# EAGLE design brmecg (EAGLE 6.1)
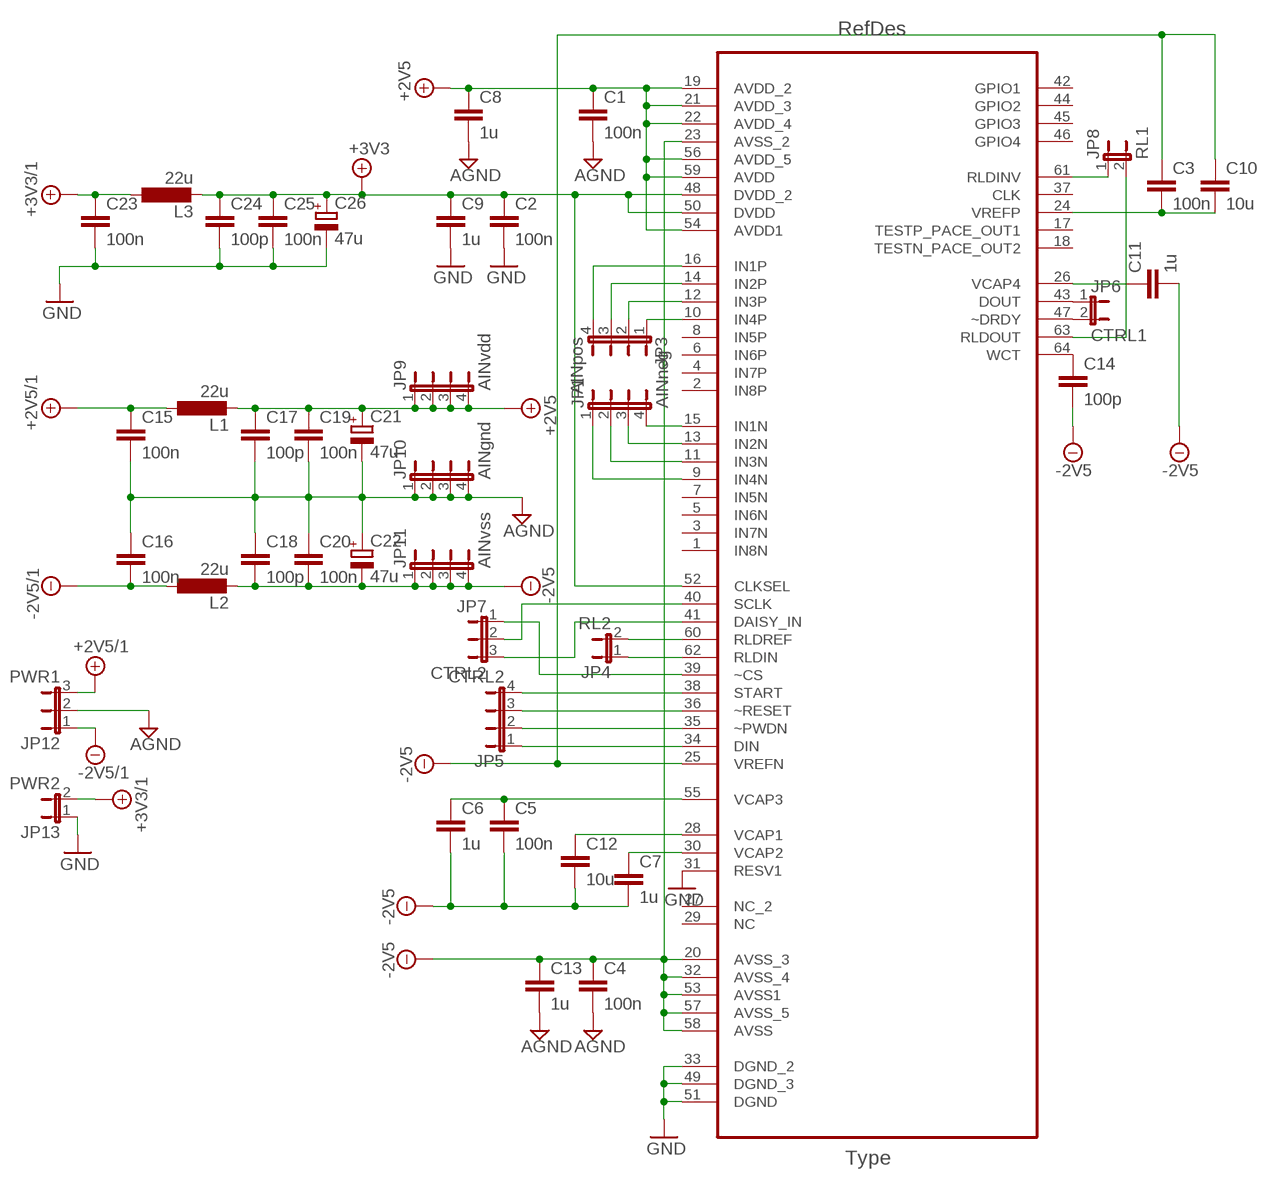
[diagram p0: schematic, sheet 1]

## Parts
C1  100n  C-EUC0603K  [C0603K]
C2  100n  C-EUC0603K  [C0603K]
C3  100n  C-EUC0603K  [C0603K]
C4  100n  C-EUC0603K  [C0603K]
C5  100n  C-EUC0603K  [C0603K]
C6  1u  C-EUC0805K  [C0805K]
C7  1u  C-EUC0805K  [C0805K]
C8  1u  C-EUC0805K  [C0805K]
C9  1u  C-EUC0805K  [C0805K]
C10  10u  C-EUC0805K  [C0805K]
C11  1u  C-EUC0805K  [C0805K]
C12  10u  C-EUC0805K  [C0805K]
C13  1u  C-EUC0805K  [C0805K]
C14  100p  C-EUC0603K  [C0603K]
C15  100n  C-EUC0603K  [C0603K]
C16  100n  C-EUC0603K  [C0603K]
C17  100p  C-EUC0603K  [C0603K]
C18  100p  C-EUC0603K  [C0603K]
C19  100n  C-EUC0603K  [C0603K]
C20  100n  C-EUC0603K  [C0603K]
C21  47u  CPOL-EUSMCC  [SMC_C]
C22  47u  CPOL-EUSMCC  [SMC_C]
C23  100n  C-EUC0603K  [C0603K]
C24  100p  C-EUC0603K  [C0603K]
C25  100n  C-EUC0603K  [C0603K]
C26  47u  CPOL-EUSMCC  [SMC_C]
JP1  AINneg  JP4E  [JP4]
JP3  AINpos  JP4E  [JP4]
JP4  RL2  JP1E  [JP1]
JP5  CTRL2  JP4E  [JP4]
JP6  CTRL1  JP1E  [JP1]
JP7  CTRL2  JP2E  [JP2]
JP8  RL1  JP1E  [JP1]
JP9  AINvdd  JP4E  [JP4]
JP10  AINgnd  JP4E  [JP4]
JP11  AINvss  JP4E  [JP4]
JP12  PWR1  JP2E  [JP2]
JP13  PWR2  JP1E  [JP1]
L1  22u  L-EUL1812  [L1812]
L2  22u  L-EUL1812  [L1812]
L3  22u  L-EUL1812  [L1812]
U1  ADS1194CPAG  [QFP50P1200X1200X120-64N]

## Nets
+2V5: C1.1 C8.1 C17.1 C19.1 C21.+ JP9.1 JP9.2 JP9.3 JP9.4 L1.2 U1.19(AVDD_2) U1.21(AVDD_3) U1.22(AVDD_4) U1.54(AVDD1) U1.56(AVDD_5) U1.59(AVDD)
+2V5/1: C15.1 JP12.3 L1.1
+3V3: C2.1 C9.1 C24.1 C25.1 C26.+ L3.2 U1.48(DVDD_2) U1.50(DVDD) U1.52(CLKSEL)
+3V3/1: C23.1 JP13.2 L3.1
-2V5: C3.1 C4.1 C5.2 C6.2 C7.2 C10.1 C11.2 C12.2 C13.1 C14.2 C18.2 C20.2 C22.- JP11.1 JP11.2 JP11.3 JP11.4 L2.2 U1.20(AVSS_3) U1.23(AVSS_2) U1.25(VREFN) U1.32(AVSS_4) U1.53(AVSS1) U1.57(AVSS_5) U1.58(AVSS)
-2V5/1: C16.2 JP12.1 L2.1
AGND: C1.2 C4.2 C8.2 C13.2 C15.2 C16.1 C17.2 C18.1 C19.2 C20.1 C21.- C22.+ JP10.1 JP10.2 JP10.3 JP10.4 JP12.2
DAISY_IN: JP7.3 U1.41(DAISY_IN)
DIN: JP5.1 U1.34(DIN)
DOUT: JP6.1 U1.43(DOUT)
GND: C2.2 C9.2 C23.2 C24.2 C25.2 C26.- JP13.1 U1.31(RESV1) U1.33(DGND_2) U1.49(DGND_3) U1.51(DGND)
N$1: C3.2 C10.2 U1.24(VREFP)
N$2: C5.1 C6.1 U1.55(VCAP3)
N$3: C7.1 U1.30(VCAP2)
N$4: C12.1 U1.28(VCAP1)
N$5: C11.1 U1.26(VCAP4)
N$6: JP1.4 U1.15(IN1N)
N$7: C14.1 U1.64(WCT)
N$8: JP1.3 U1.13(IN2N)
N$9: JP1.2 U1.11(IN3N)
N$10: JP1.1 U1.9(IN4N)
N$11: JP3.1 U1.10(IN4P)
N$12: JP3.4 U1.16(IN1P)
N$13: JP3.3 U1.14(IN2P)
N$14: JP3.2 U1.12(IN3P)
N$15: JP4.1 U1.62(RLDIN)
N$16: JP4.2 U1.60(RLDREF)
N$17: JP8.1 U1.61(RLDINV)
N$24: JP8.2 U1.63(RLDOUT)
SCLK: JP7.2 U1.40(SCLK)
START: JP5.4 U1.38(START)
~CS: JP7.1 U1.39(~CS)
~DRDY: JP6.2 U1.47(~DRDY)
~PWDN: JP5.2 U1.35(~PWDN)
~RESET: JP5.3 U1.36(~RESET)
Unconnected: U1.1(IN8N) U1.2(IN8P) U1.3(IN7N) U1.4(IN7P) U1.5(IN6N) U1.6(IN6P) U1.7(IN5N) U1.8(IN5P) U1.17(TESTP_PACE_OUT1) U1.18(TESTN_PACE_OUT2) U1.27(NC_2) U1.29(NC) U1.37(CLK) U1.42(GPIO1) U1.44(GPIO2) U1.45(GPIO3) U1.46(GPIO4)

## Library data of the parts
C1-C20 C23-C25 = rcl:C-EU: CAPACITOR, European symbol
C21 C22 C26 = rcl:CPOL-EU: POLARIZED CAPACITOR, European symbol
JP1 JP3 JP5 JP9-JP11 = jumper:JP4E: JUMPER
JP4 JP6 JP8 JP13 = jumper:JP1E: JUMPER
JP7 JP12 = jumper:JP2E: JUMPER
L1-L3 = rcl:L-EU: INDUCTOR, European symbol
U1 = adc-ti:ADS1194CPAG: Analog Front-End for Biopotential Measurements; DESCRIPTION: Analog Front-End for Biopotential Measurements; MPN: ADS1194CPAG; OC_FARNELL: 1855110; OC_NEWARK: 13T1868; PACKAGE: TQFP-64; SUPPLIER: Texas Instruments

## Board
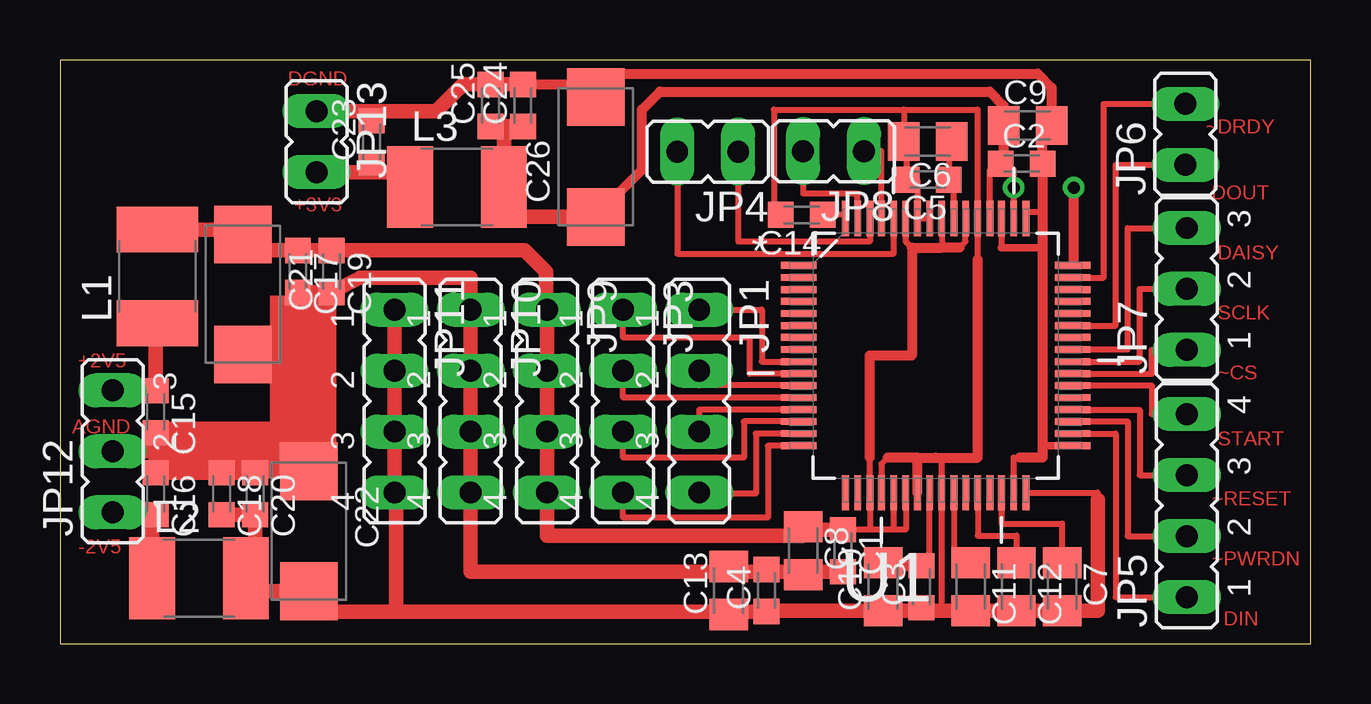
[diagram p1: board, top side]
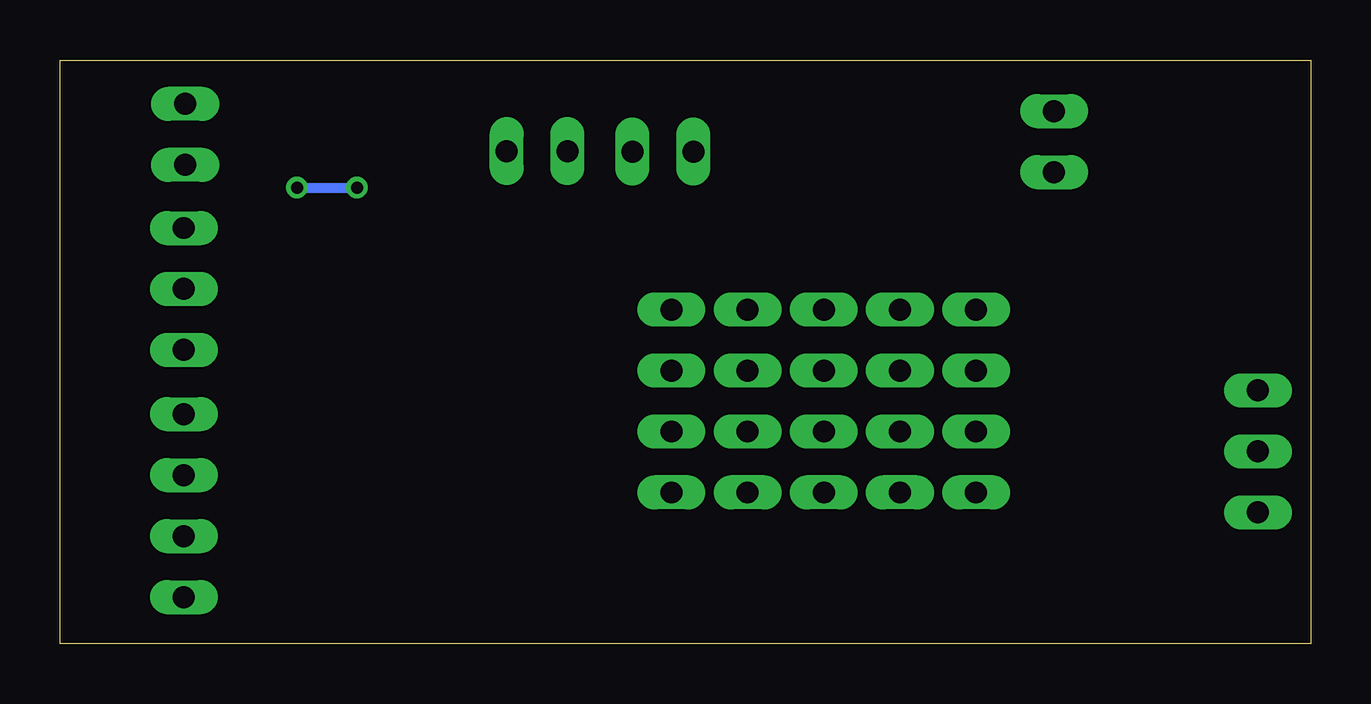
[diagram p2: board, bottom side, seen from below]

Size 52.13 x 24.32 mm. Coordinates in mm from the lower left corner, seen from the top.
Outline: 0,0 52.13,0 52.13,24.32 0,24.32 0,0
Copper layers (1*16): Top 0.035mm / dielectric 1.5mm / Bottom 0.035mm
Design rules: minimum track width 10mil, minimum drill 24mil, track to track 8mil, track to pad 8mil, pad to pad 8mil, via to via 8mil, smd to smd 8mil, copper to edge 40mil, drill to drill 8mil, minimum pad ring 10mil, minimum via ring 8mil, stop-mask expansion 4mil, vias tented up to drill 0mil, thermal gap 10mil

### Footprints (pad centres in the part's own frame; a part is rotated, then mirrored left to right if it is on the bottom)
C0603K = smd 1.05 x 1.08: 1 -0.875,0; 2 0.875,0
C0805K = smd 1.3 x 1.6: 1 -1,0; 2 1,0
SMC_C = smd 2.4 x 2.4: + -2.5,0; - 2.5,0
JP4 = drill 0.914 long: 1 -3.81,0; 2 -1.27,0; 3 1.27,0; 4 3.81,0
JP1 = drill 0.914 long: 1 0,-1.27; 2 0,1.27
JP2 = drill 0.914 long: 1 -2.54,0; 2 0,0; 3 2.54,0
L1812 = smd 1.9 x 3.4: 1 -1.95,0; 2 1.95,0
QFP50P1200X1200X120-64N = smd 1.473 x 0.279: 1 -5.715,3.759; 2 -5.715,3.251; 3 -5.715,2.743; 4 -5.715,2.261; 5 -5.715,1.753; 6 -5.715,1.245; 7 -5.715,0.762; 8 -5.715,0.254; 9 -5.715,-0.254; 10 -5.715,-0.762; 11 -5.715,-1.245; 12 -5.715,-1.753; 13 -5.715,-2.261; 14 -5.715,-2.743; 15 -5.715,-3.251; 16 -5.715,-3.759; 33 5.715,-3.759; 34 5.715,-3.251; 35 5.715,-2.743; 36 5.715,-2.261; 37 5.715,-1.753; 38 5.715,-1.245; 39 5.715,-0.762; 40 5.715,-0.254; 41 5.715,0.254; 42 5.715,0.762; 43 5.715,1.245; 44 5.715,1.753; 45 5.715,2.261; 46 5.715,2.743; 47 5.715,3.251; 48 5.715,3.759 | smd 0.279 x 1.473: 17 -3.759,-5.715; 18 -3.251,-5.715; 19 -2.743,-5.715; 20 -2.261,-5.715; 21 -1.753,-5.715; 22 -1.245,-5.715; 23 -0.762,-5.715; 24 -0.254,-5.715; 25 0.254,-5.715; 26 0.762,-5.715; 27 1.245,-5.715; 28 1.753,-5.715; 29 2.261,-5.715; 30 2.743,-5.715; 31 3.251,-5.715; 32 3.759,-5.715; 49 3.759,5.715; 50 3.251,5.715; 51 2.743,5.715; 52 2.261,5.715; 53 1.753,5.715; 54 1.245,5.715; 55 0.762,5.715; 56 0.254,5.715; 57 -0.254,5.715; 58 -0.762,5.715; 59 -1.245,5.715; 60 -1.753,5.715; 61 -2.261,5.715; 62 -2.743,5.715; 63 -3.251,5.715; 64 -3.759,5.715

### Placement (x,y rotation side)
C1  32.63,3.87 270 top
C2  40.08,20 0 top
C3  35.9,2.37 90 top
C4  29.45,2.21 90 top
C5  36.17,19.33 180 top
C6  36.17,20.92 180 top
C7  41.77,2.37 270 top
C8  30.98,3.87 270 top
C9  40.33,21.59 0 top
C10  34.3,2.37 90 top
C11  37.96,2.37 270 top
C12  39.87,2.37 270 top
C13  27.87,2.21 90 top
C14  30.92,17.86 180 top
C15  3.98,9.66 270 top
C16  3.98,6.24 270 top
C17  9.91,15.51 270 top
C18  6.74,6.25 270 top
C19  11.32,15.51 270 top
C20  8.14,6.25 270 top
C21  7.62,14.55 270 top
C22  10.38,4.68 270 top
C23  12.98,20.91 90 top
C24  19.3,22.42 90 top
C25  17.95,22.42 90 top
C26  22.33,20.28 90 top
JP1  26.64,10.11 270 top
JP3  23.47,10.11 270 top
JP4  27,20.5 90 top
JP5  46.97,5.75 90 top
JP6  46.91,21.21 0 top
JP7  46.97,14.78 90 top
JP8  32.24,20.52 90 top
JP9  20.3,10.11 270 top
JP10  17.12,10.11 270 top
JP11  13.95,10.11 270 top
JP12  2.19,8.01 90 top
JP13  10.7,20.91 180 top
L1  4.07,15.29 90 top
L2  5.79,2.72 0 top
L3  16.55,19.02 0 top
U1  36.5,12 0 top

### Tracks (layer width: path | path; a pad name or v marks a point on that pad's centre or on a via)
+2V5
  Top 0.254: U1.56 36.75,16.5 | U1.54 37.74,16.75 37.5,16.5 | 33.76,4.75 U1.19 33.75,7.75 | 33.76,4.75 33.5,4.75 C1.1 | U1.21 34.75,4.75 | 34.75,4.75 33.76,4.75 | U1.22 35.25,4.75 34.75,4.75 | 35.51,16.5 35.26,16.75 U1.59
  Top 0.406: 37.5,16.5 36.75,16.5 35.51,16.5 35.51,12 33.76,12 33.76,7.75 33.75,7.75
  Top 0.61: C1.1 30.98,4.75 C8.1 30.98,4.5 20.3,4.5 JP9.4 JP9.3 JP9.2 JP9.1 20.25,13.96 20.25,15.5 19.37,16.38 C19.1 C17.1 7.62,16.38 C21.+ 7.62,17.25 L1.2
+2V5/1
  Top 0.61: L1.1 3.98,13.35 C15.1 JP12.3
+3V3  (via drill 0.5)
  Top 0.254: U1.52 38.76,19.75 C2.1 39.75,19.75 v39.75,19 U1.50 | U1.48 42.25,15.76 42.25,16
  Top 0.406: C2.1 39.33,19.75 C9.1 39.33,22.42 38.75,23 25,23 24.25,22.25 24.25,19.75 22.33,17.83 C26.+ | 42.25,16 v42.25,19
  Top 0.61: C25.1 18.5,21.55 | 18.5,21.55 C24.1 | 18.5,21.55 L3.2 18.5,17.78 C26.+
  Bottom 0.406: v42.25,19 v39.75,19
+3V3/1
  Top 0.61: JP13.2 13,19.64 | 13,19.64 13.98,19.64 L3.1 | C23.1 12.98,19.66 13,19.64
-2V5
  Top 0.254: U1.57 U1.58 35.74,19.33 C5.2 35.29,20.92 C6.2 | 35.17,22.25 29.75,22.25 29.75,17.86 C14.2 | 35.17,22.25 38.25,22.25 U1.53 38.25,16 | 35.17,22.25 C6.2 | C6.2 35.17,20.75 35.25,20.75 | 36.75,1.5 U1.25 36.75,7.75 36.5,7.75 | C10.1 34.3,1.58 | U1.32 43.25,6.29 43.25,6 | 34.5,7.75 34.24,7.49 U1.20
  Top 0.406: C13.1 27.87,1.33 | C4.1 29.45,1.37 | 36.75,1.37 36.75,1.5 | 35.9,1.37 C3.1 | 35.74,7.75 36.5,7.75 38.25,7.75 38.25,16 | U1.23 35.74,7.75 | 35.74,7.75 34.5,7.75
  Top 0.61: JP11.1 JP11.2 JP11.3 JP11.4 14,6.29 14,1.33 | C4.1 27.87,1.33 14,1.33 | 29.45,1.37 C10.1 35.9,1.37 36.75,1.37 C11.2 C12.2 C7.2 43.25,1.37 43.25,6 | 14,1.33 10.5,1.33 10.5,2 10.38,2 C22.- 7.75,2.18 L2.2 8.14,2.72 C20.2 C18.2
-2V5/1
  Top 0.61: JP12.1 3.98,5.47 C16.2 3.85,5.37 L2.1
AGND
  Top 0.254: 32.63,3.12 C1.2
  Top 0.61: 29.45,3 C1.2 30.98,3 C8.2 | 27.87,3 17.12,3 JP10.4 JP10.3 JP10.2 JP10.1 17.12,15.25 12.5,15.25 C19.2 C17.2 9.75,14.63 9.75,12.05 | C4.2 29.45,3 | C13.2 27.87,3 | 27.87,3 29.45,3 | C22.+ 9.75,7.18 | 9.75,7.18 8.14,7.18 C20.1 C18.1 C16.1 3.98,8.01 | C15.2 3.98,8.01 | 9.75,12.05 9.75,7.18 | JP12.2 3.98,8.01 | C21.- 9.75,12.05
DAISY_IN
  Top 0.254: U1.41 44.5,12.25 44.5,17.32 JP7.3
DIN
  Top 0.254: U1.34 44,8.75 44,1.94 JP5.1
DOUT
  Top 0.254: U1.43 44,13.24 44,19.95 JP6.1
GND
  Top 0.254: U1.51 39.24,16.5 | U1.49 40.26,18 40.96,18 | U1.33 | U1.31 39.75,7.75 40,7.75
  Top 0.305: 39.24,16.5 40.96,16.5 | U1.33 40.96,8.25
  Top 0.406: 40,7.75 40.96,7.75 40.96,8.25 40.96,16.5 40.96,18 C2.2 40.96,21.59 C9.2 41.33,23.17 40.75,23.75 22.33,23.75 C26.- 21.82,23.3 C24.2
  Top 0.61: JP13.1 13.25,22.18 | 13.25,22.18 15.68,22.18 16.8,23.3 C25.2 C24.2 | C23.2 13.25,22.05 13.25,22.18
N$1
  Top 0.254: C3.2 36.25,3.25 U1.24
  Top 0.406: C10.2 34.3,3.25 C3.2
N$2
  Top 0.254: U1.55 37.26,19.33 C5.1 37.04,20.92 C6.1
N$3
  Top 0.254: U1.30 39.24,5 41.77,5 C7.1
N$4
  Top 0.254: U1.28 38.25,4.5 39.87,4.5 C12.1
N$5
  Top 0.254: U1.26 37.26,3.37 C11.1
N$6
  Top 0.254: U1.15 29,8.75 29,6.25 26.64,6.25 JP1.4
N$7
  Top 0.254: U1.64 32.74,17.86 C14.1
N$8
  Top 0.254: U1.13 26.64,9.74 JP1.3
N$9
  Top 0.254: U1.11 26.64,10.76 JP1.2
N$10
  Top 0.254: JP1.1 29.25,13.91 29.25,11.75 U1.9
N$11
  Top 0.254: U1.10 28.75,11.24 28.75,12.75 23.47,12.75 JP3.1
N$12
  Top 0.254: U1.16 29.5,8.24 29.5,5.25 23.47,5.25 JP3.4
N$13
  Top 0.254: U1.14 28.5,9.26 28.5,7.75 23.47,7.75 JP3.3
N$14
  Top 0.254: U1.12 23.47,10.25 JP3.2
N$15
  Top 0.254: U1.62 33.76,16.75 28.27,16.75 JP4.1
N$16
  Top 0.254: JP4.2 25.73,16.25 34.75,16.25 U1.60
N$17
  Top 0.254: U1.61 34.24,20.52 JP8.1
N$24
  Top 0.254: U1.63 33.25,18.75 30.98,18.75 JP8.2
SCLK
  Top 0.254: U1.40 45,11.75 45,14.78 JP7.2
START
  Top 0.254: U1.38 45.5,10.76 45.5,9.55 JP5.4
~CS
  Top 0.254: U1.39 45.5,11.24 45.5,12.23 JP7.1
~DRDY
  Top 0.254: U1.47 43.5,15.25 43.5,22.48 JP6.2
~PWDN
  Top 0.254: U1.35 44.5,9.26 44.5,4.47 JP5.2
~RESET
  Top 0.254: U1.36 45,9.74 45,7.01 JP5.3
(copper drawn outside any net)
  shapes: Top area x2

### Text on the board
Top: DGND | ~DRDY | +3V3 | DOUT | DAISY | SCLK | +2V5 | ~CS | AGND | START | ~RESET | -2V5 | ~PWRDN | DIN